# Altium schematic sheet project_4.SchDoc
size A4; SheetNumber: 1; SheetTotal: 1
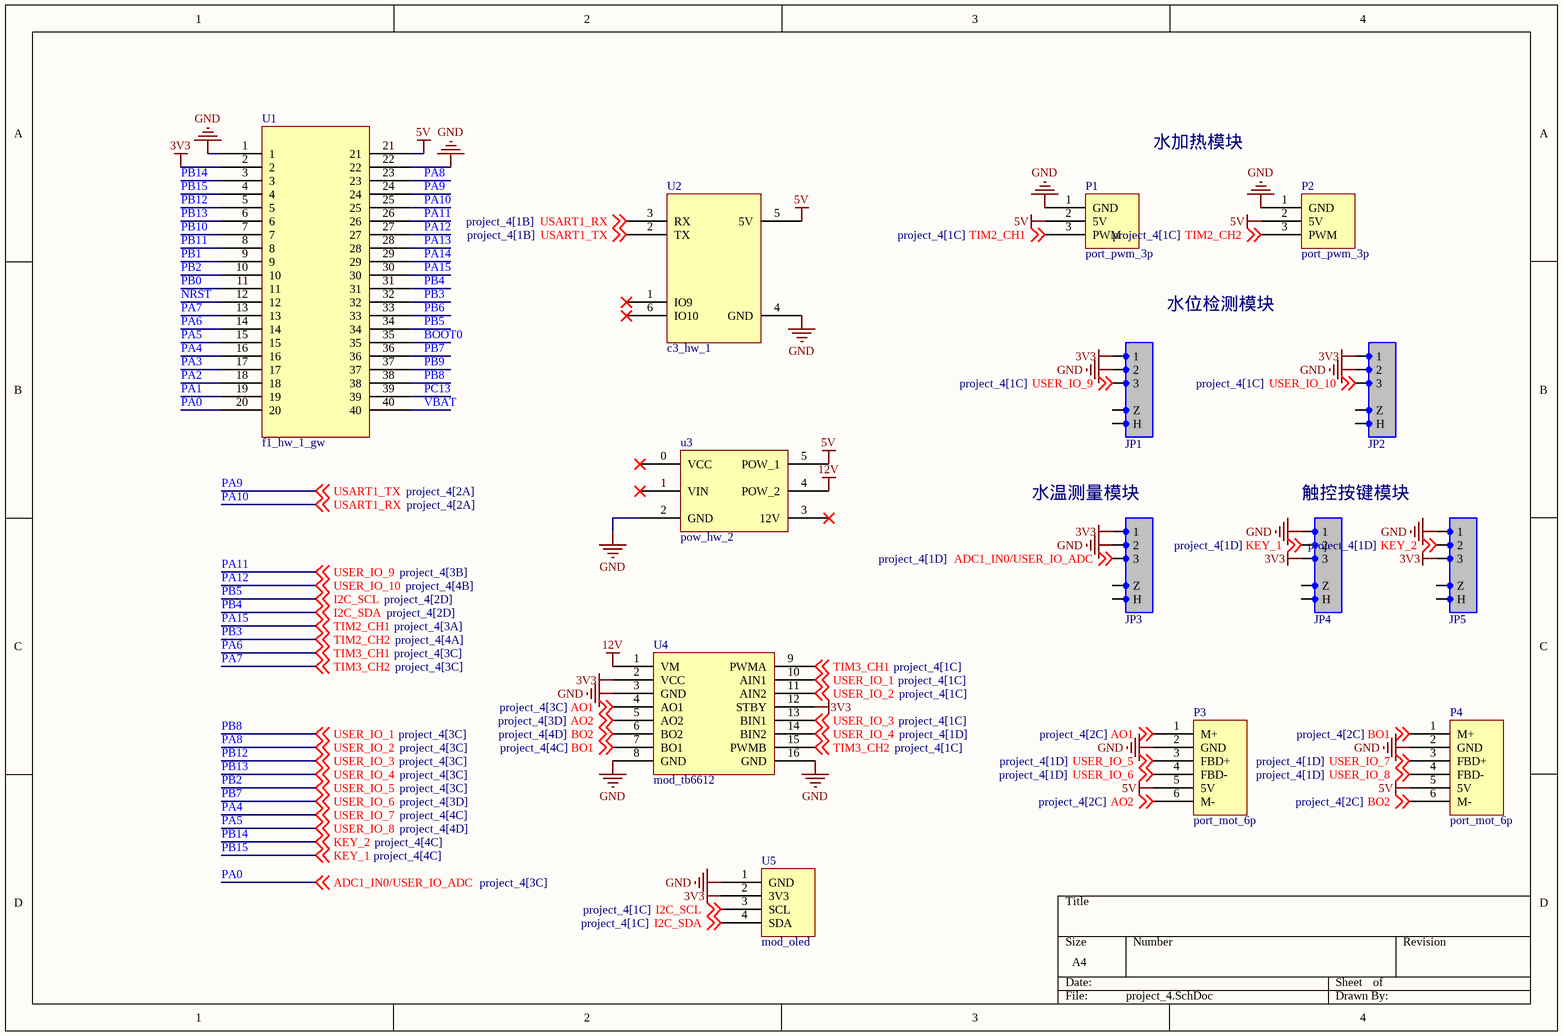
[diagram p0: project_4.SchDoc]

## Parts
JP1  HDR-1X3  [XH2.54-WI-3P]  (value not drawn)
JP2  HDR-1X3  [XH2.54-WI-3P]  (value not drawn)
JP3  HDR-1X3  [XH2.54-WI-3P]  (value not drawn)
JP4  HDR-1X3  [HDR2.54-LI-3P]  (value not drawn)
JP5  HDR-1X3  [HDR2.54-LI-3P]  (value not drawn)
P1  port_pwm_3p  [XH2.54_3P]
P2  port_pwm_3p  [XH2.54_3P]
P3  port_mot_6p  [XH2.54_6P]
P4  port_mot_6p  [XH2.54_6P]
U1  f1_hw_1_gw  [F1_HW_1_GW]
U2  c3_hw_1  [C3_HW_1]
u3  pow_hw_2  [pow_hw_2]
U4  mod_tb6612  [MOD_TB6612]
U5  mod_oled  [mod_oled]

## Nets
3V3: JP1.1 JP2.1 JP3.1 JP4.3 JP5.3 U1.2 U4.2(VCC) U4.12(STBY) U5.2(3V3)
5V: P1.2(5V) P2.2(5V) P3.5(5V) P4.5(5V) U1.21 U2.5(5V) u3.5(POW_1)
12V: u3.4(POW_2) U4.1(VM)
GND: JP1.2 JP2.2 JP3.2 JP4.1 JP5.1 P1.1(GND) P2.1(GND) P3.2(GND) P4.2(GND) U1.1 U1.22 U2.4(GND) u3.2(GND) U4.3(GND) U4.8(GND) U4.16(GND) U5.1(GND)
AO1: P3.1(M+) U4.4(AO1) ; off-sheet AO1
AO2: P3.6(M-) U4.5(AO2) ; off-sheet AO2
BO1: P4.1(M+) U4.7(BO1) ; off-sheet BO1
BO2: P4.6(M-) U4.6(BO2) ; off-sheet BO2
BOOT0: U1.35
NRST: U1.12
PA0: JP3.3 U1.20 ; off-sheet ADC1_IN0/USER_IO_ADC  [also labelled ADC1_IN0/USER_IO_ADC]
PA1: U1.19
PA2: U1.18
PA3: U1.17
PA4: P4.3(FBD+) U1.16 ; off-sheet USER_IO_7  [also labelled USER_IO_7]
PA5: P4.4(FBD-) U1.15 ; off-sheet USER_IO_8  [also labelled USER_IO_8]
PA6: U1.14 U4.9(PWMA) ; off-sheet TIM3_CH1  [also labelled TIM3_CH1]
PA7: U1.13 U4.15(PWMB) ; off-sheet TIM3_CH2  [also labelled TIM3_CH2]
PA8: U1.23 U4.11(AIN2) ; off-sheet USER_IO_2  [also labelled USER_IO_2]
PA9: U1.24 U2.2(TX) ; off-sheet USART1_TX  [also labelled USART1_TX]
PA10: U1.25 U2.3(RX) ; off-sheet USART1_RX  [also labelled USART1_RX]
PA11: JP1.3 U1.26 ; off-sheet USER_IO_9  [also labelled USER_IO_9]
PA12: JP2.3 U1.27 ; off-sheet USER_IO_10  [also labelled USER_IO_10]
PA13: U1.28
PA14: U1.29
PA15: P1.3(PWM) U1.30 ; off-sheet TIM2_CH1  [also labelled TIM2_CH1]
PB0: U1.11
PB1: U1.9
PB2: P3.3(FBD+) U1.10 ; off-sheet USER_IO_5  [also labelled USER_IO_5]
PB3: P2.3(PWM) U1.32 ; off-sheet TIM2_CH2  [also labelled TIM2_CH2]
PB4: U1.31 U5.4(SDA) ; off-sheet I2C_SDA  [also labelled I2C_SDA]
PB5: U1.34 U5.3(SCL) ; off-sheet I2C_SCL  [also labelled I2C_SCL]
PB6: U1.33
PB7: P3.4(FBD-) U1.36 ; off-sheet USER_IO_6  [also labelled USER_IO_6]
PB8: U1.38 U4.10(AIN1) ; off-sheet USER_IO_1  [also labelled USER_IO_1]
PB9: U1.37
PB10: U1.7
PB11: U1.8
PB12: U1.5 U4.13(BIN1) ; off-sheet USER_IO_3  [also labelled USER_IO_3]
PB13: U1.6 U4.14(BIN2) ; off-sheet USER_IO_4  [also labelled USER_IO_4]
PB14: JP5.2 U1.3 ; off-sheet KEY_2  [also labelled KEY_2]
PB15: JP4.2 U1.4 ; off-sheet KEY_1  [also labelled KEY_1]
PC13: U1.39
VBAT: U1.40

Not connected (* = marked no-connect by the designer): JP1 0(Z) 100(H); JP2 0(Z) 100(H); JP3 0(Z) 100(H); JP4 0(Z) 100(H); JP5 0(Z) 100(H); U2 1(IO9)* 6(IO10)*; u3 0(VCC)* 1(VIN)* 3(12V)*

## Notes on the sheet
- 水加热模块
- 水位检测模块
- 水温测量模块
- (near JP4) 触控按键模块

## Library data of the parts
JP1-JP5 = Header 3: 3P接插件; 版权归属: 源创客; BOM名称: 3P接插件; 学习资源: www.ooocke.com
P1 P2 = port_pwm_3p: 舵机接口 / XH2.54弯排针3p
P3 P4 = port_mot_6p: 闭环直流电机接口 / XH2.54弯排针6p
U2 = c3_hw_1: ESP32C3蓝牙模块 / 6p排母
u3 = pow_hw_2: 两路升降压电源模块 / 6p排母*2
U4 = mod_tb6612: TB6612模块 / 8p排母*2
U5 = mod_oled: oled模块 / 4p排母